# Altium schematic sheet Sheet1.SchDoc
size A
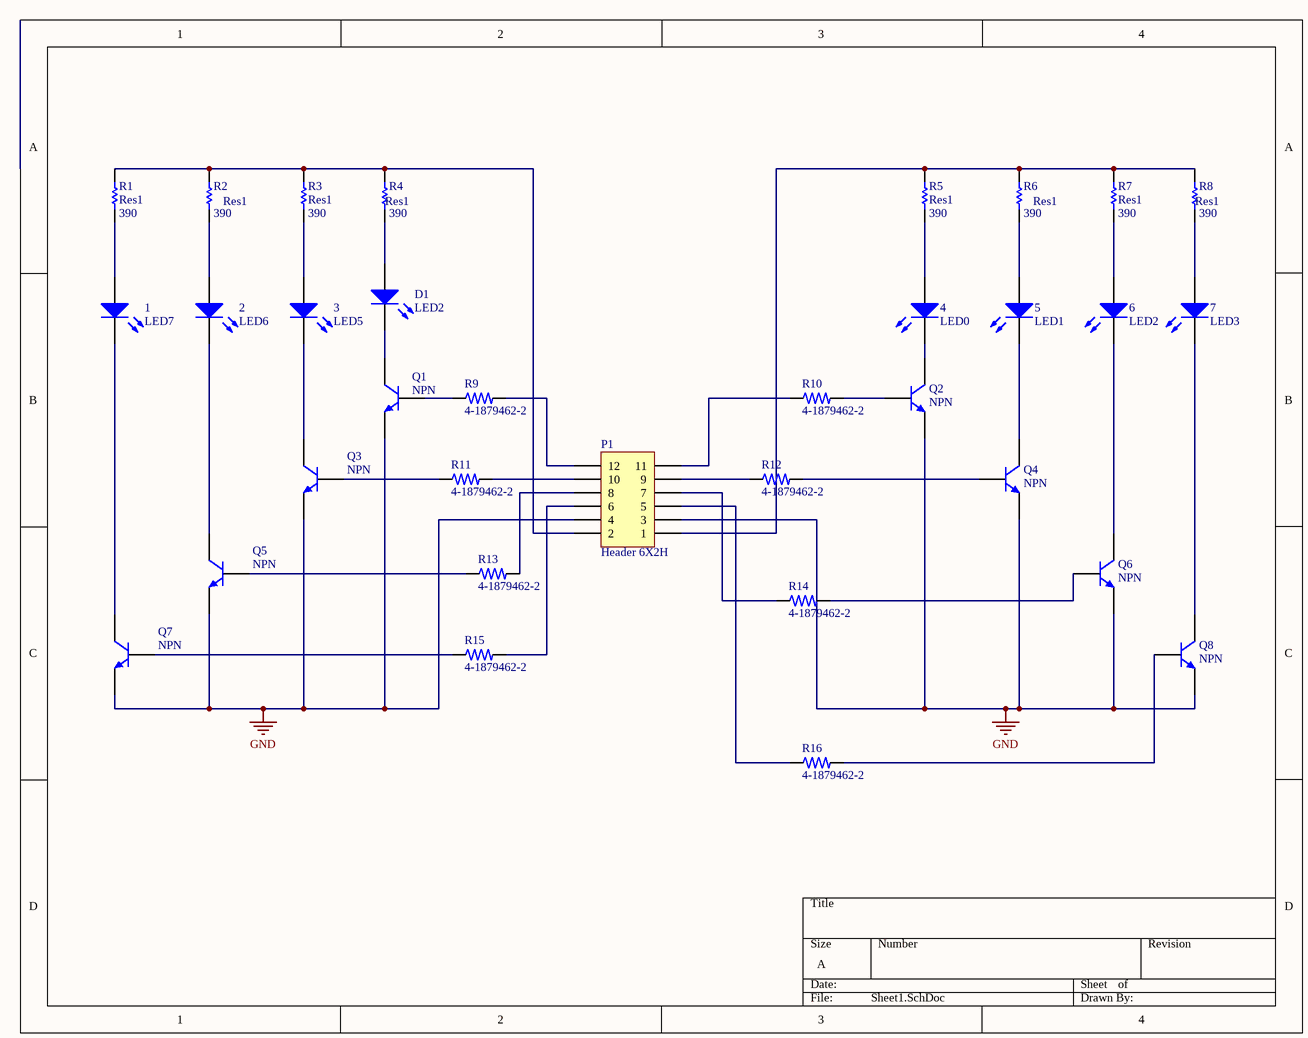
[diagram p0: Sheet1.SchDoc]

## Parts
1  LED7  [3.2X1.6X1.1]
2  LED6  [3.2X1.6X1.1]
3  LED5  [3.2X1.6X1.1]
4  LED0  [3.2X1.6X1.1]
5  LED1  [3.2X1.6X1.1]
6  LED2  [3.2X1.6X1.1]
7  LED3  [3.2X1.6X1.1]
D1  LED2  [3.2X1.6X1.1]
P1  Header 6X2H  [HDR2X6H]
Q1  NPN  [TO-226-AA]
Q2  NPN  [TO-226-AA]
Q3  NPN  [TO-226-AA]
Q4  NPN  [TO-226-AA]
Q5  NPN  [TO-226-AA]
Q6  NPN  [TO-226-AA]
Q7  NPN  [TO-226-AA]
Q8  NPN  [TO-226-AA]
R1  Res1  value 390  [AXIAL-0.3]
R2  Res1  value 390  [AXIAL-0.3]
R3  Res1  value 390  [AXIAL-0.3]
R4  Res1  value 390  [AXIAL-0.3]
R5  Res1  value 390  [AXIAL-0.3]
R6  Res1  value 390  [AXIAL-0.3]
R7  Res1  value 390  [AXIAL-0.3]
R8  Res1  value 390  [AXIAL-0.3]
R9  4-1879462-2  [RESC3115X65N]
R10  4-1879462-2  [RESC3115X65N]
R11  4-1879462-2  [RESC3115X65N]
R12  4-1879462-2  [RESC3115X65N]
R13  4-1879462-2  [RESC3115X65N]
R14  4-1879462-2  [RESC3115X65N]
R15  4-1879462-2  [RESC3115X65N]
R16  4-1879462-2  [RESC3115X65N]

## Nets
GND: P1.3 P1.4 Q1.3(E) Q2.3(E) Q3.3(E) Q4.3(E) Q5.3(E) Q6.3(E) Q7.3(E) Q8.3(E)
Net1_1: 1.1(A) R1.1
Net1_2: 1.2(K) Q7.1(C)
Net2_1: 2.1(A) R2.1
Net2_2: 2.2(K) Q5.1(C)
Net3_1: 3.1(A) R3.1
Net3_2: 3.2(K) Q3.1(C)
Net4_1: 4.1(A) R5.1
Net4_2: 4.2(K) Q2.1(C)
Net5_1: 5.1(A) R6.1
Net5_2: 5.2(K) Q4.1(C)
Net6_1: 6.1(A) R7.1
Net6_2: 6.2(K) Q6.1(C)
Net7_1: 7.1(A) R8.1
Net7_2: 7.2(K) Q8.1(C)
NetD1_1: D1.1(A) R4.1
NetD1_2: D1.2(K) Q1.1(C)
NetP1_1: P1.1 R5.2 R6.2 R7.2 R8.2
NetP1_2: P1.2 R1.2 R2.2 R3.2 R4.2
NetP1_5: P1.5 R16.1
NetP1_6: P1.6 R15.2
NetP1_7: P1.7 R14.1
NetP1_8: P1.8 R13.2
NetP1_9: P1.9 R12.1
NetP1_10: P1.10 R11.2
NetP1_11: P1.11 R10.1
NetP1_12: P1.12 R9.2
NetQ1_2: Q1.2(B) R9.1
NetQ2_2: Q2.2(B) R10.2
NetQ3_2: Q3.2(B) R11.1
NetQ4_2: Q4.2(B) R12.2
NetQ5_2: Q5.2(B) R13.1
NetQ6_2: Q6.2(B) R14.2
NetQ7_2: Q7.2(B) R15.1
NetQ8_2: Q8.2(B) R16.2

## Library data of the parts
1-7 D1 = LED2: Typical RED, GREEN, YELLOW, AMBER GaAs LED; Published: 8-Jun-2000; LatestRevisionDate: 17-Jul-2002; LatestRevisionNote: Re-released for DXP Platform.; PackageVersion: Feb-2002; PackageReference: 3.2X1.6X1.1; Publisher: Altium Limited; PackageDescription: SM LED; 2 Flat Leads
P1 = Header 6X2H: Header, 6-Pin, Dual row, Right Angle; LatestRevisionDate: 17-Jul-2002; LatestRevisionNote: Re-released for DXP Platform.; Publisher: Altium Limited
Q1-Q8 = NPN: NPN Bipolar Transistor; Published: 8-Jun-2000; LatestRevisionDate: 17-Jul-2002; LatestRevisionNote: Re-released for DXP Platform.; PackageReference: TO-226-AA; Publisher: Altium Limited; PackageDescription: TO, Flat Index; 3 In-Line, Axial Leads; Body Dia. 4.8mm; Leads 0.55 x 0.51 mm (max); Code_JEDEC: TO-226-AA
R1-R8 = Res1: Resistor; Published: 8-Jun-2000; LatestRevisionDate: 17-Jul-2002; LatestRevisionNote: Re-released for DXP Platform.; PackageReference: AXIAL-0.3; Publisher: Altium Limited; PackageDescription: Axial Device, Thru-Hole; 2 Leads; 0.3 in Pin Spacing
R9-R16 = 4-1879462-2: RL73H 2B R82 1% 1K RL; Package: None; Price: None; Value: *; MP: 4-1879462-2; Availability: Unavailable